# Altium schematic sheet Communication.SchDoc
size A4
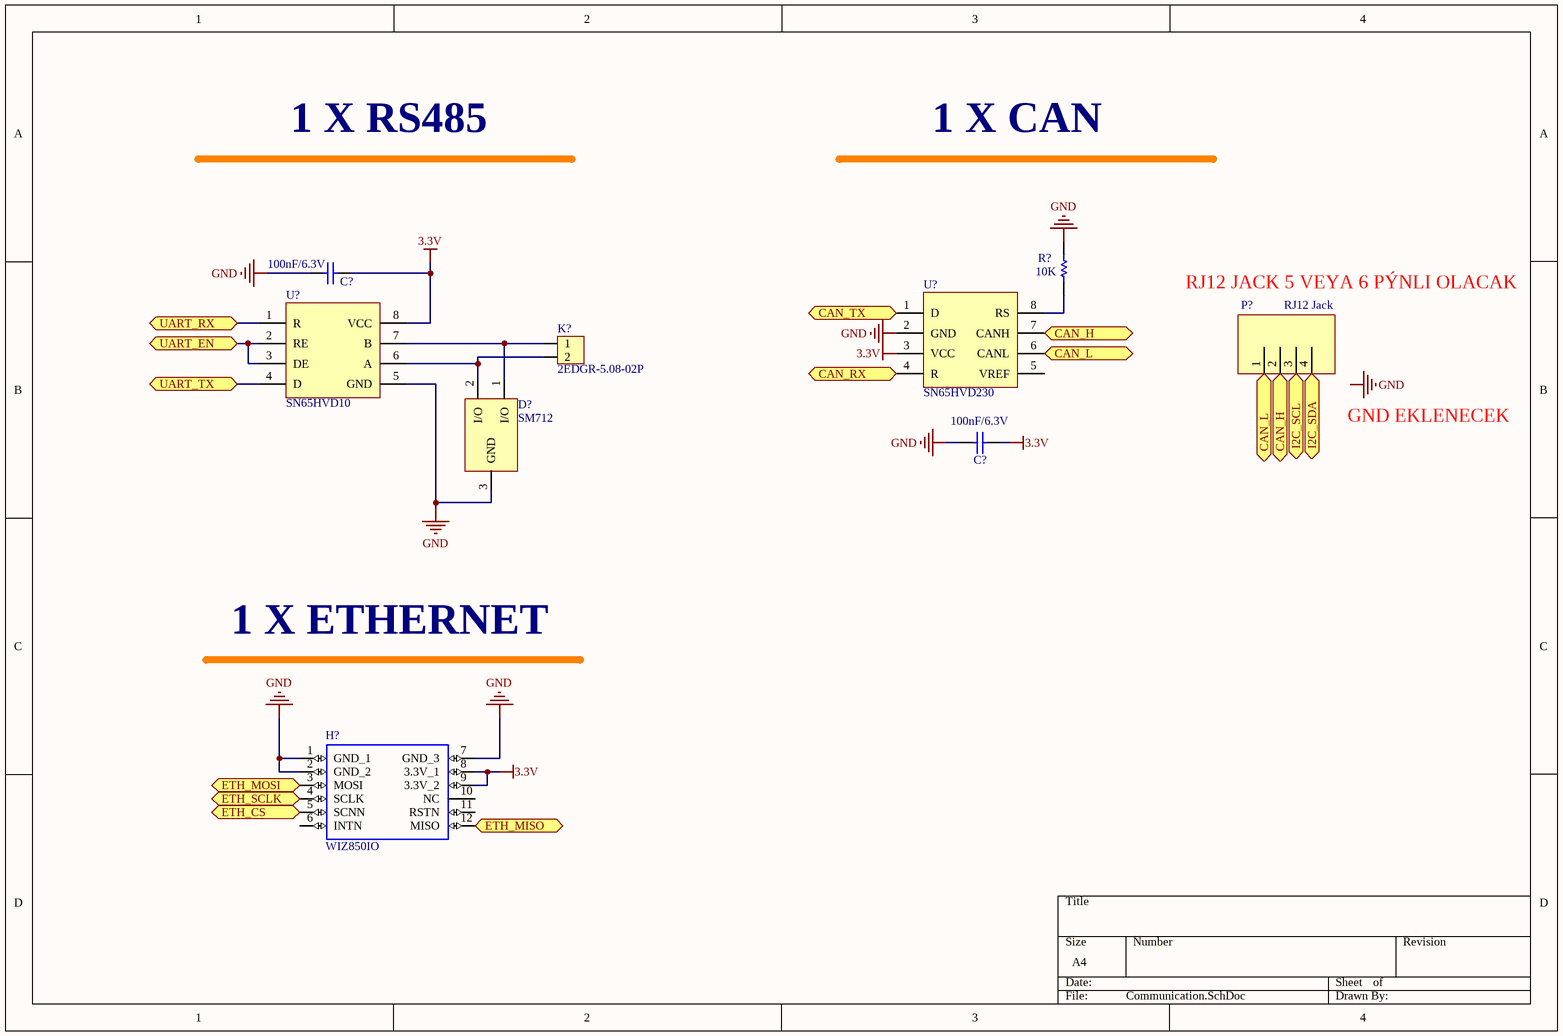
[diagram p0: Communication.SchDoc]

## Parts
(Parts that share a designator on the sheet are numbered #1, #2 ... from top to bottom, then left to right.)
C?#1  100nF/6.3V  [CAP0603W]
C?#2  100nF/6.3V  [CAP0603W]
D?  SM712  [SOT23 - BC8X6]
H?  WIZ850IO  [WIZ850IO]
K?  2EDGR-5.08-02P  [CON_DG129_02P]
P?  RJ12 Jack  [rj12_90deg_con_4p4c]
R?  10K  [RES1608[0603]]
U?#1  SN65HVD230  [SO8]
U?#2  SN65HVD10  [SO8]

## Ports
CAN_H, CAN_L, CAN_RX, CAN_TX, ETH_CS, ETH_MISO, ETH_MOSI, ETH_SCLK, I2C_SCL, I2C_SDA, UART_EN, UART_RX, UART_TX

## Nets
3.3V: C?#1.2 C?#2.2 H?.8(3.3V_1) H?.9(3.3V_2) U?#1.3(VCC) U?#2.8(VCC)
GND: C?#1.1 C?#2.1 D?.3(GND) H?.1(GND_1) H?.2(GND_2) H?.7(GND_3) R?.1 U?#1.2(GND) U?#2.5(GND)
CAN_H: P?.2 U?#1.7(CANH) ; port CAN_H
CAN_L: P?.1 U?#1.6(CANL) ; port CAN_L
CAN_RX: U?#1.4(R) ; port CAN_RX
CAN_TX: U?#1.1(D) ; port CAN_TX
ETH_CS: H?.5(SCNN) ; port ETH_CS
ETH_MISO: H?.12(MISO) ; port ETH_MISO
ETH_MOSI: H?.3(MOSI) ; port ETH_MOSI
ETH_SCLK: H?.4(SCLK) ; port ETH_SCLK
I2C_SCL: P?.3 ; port I2C_SCL
I2C_SDA: P?.4 ; port I2C_SDA
UART_EN: U?#2.2(RE) U?#2.3(DE) ; port UART_EN
UART_RX: U?#2.1(R) ; port UART_RX
UART_TX: U?#2.4(D) ; port UART_TX
NetD?_1: D?.1(I/O) K?.1 U?#2.7(B)
NetD?_2: D?.2(I/O) K?.2 U?#2.6(A)
NetR?_2: R?.2 U?#1.8(RS)

Not connected (* = marked no-connect by the designer): H? 6(INTN) 10(NC) 11(RSTN); U?#1 5(VREF)

## Notes on the sheet
- 1 X RS485
- 1 X CAN
- (near P?) RJ12 JACK 5 VEYA 6 PÝNLI OLACAK
- GND EKLENECEK
- 1 X ETHERNET
- Labels drawn without touching a wire or pin: GND

## Library data of the parts
C?#1 C?#2 = CAP1: CAPACITOR 0603 Case; Value: 100nF; Published: 8-Jun-2000; LatestRevisionDate: 17-Jul-2002; LatestRevisionNote: Re-released for DXP Platform.; PackageReference: C1206; Publisher: Altium Limited
D? = SM712: DIODE TVS Array For Rs485
H? = WIZ850IO: Ethernet - 10/100 Base-T/TX PHY SPI Interface Module; MF: WIZnet; Value: *; Package: Module WIZnet; Availability: In Stock; Check_prices: https://www.snapeda.com/parts/WIZ850IO/WIZnet/view-part/?ref=eda; SnapEDA_Link: https://www.snapeda.com/parts/WIZ850IO/WIZnet/view-part/?ref=snap; Purchase-URL: https://pricing.snapeda.com/search/part/WIZ850IO/?ref=eda; MP: WIZ850IO; Price: None
K? = KLEMENS_2P: CONNECTOR 5.08mm 2PIN 90DEG
P? = RJ12_4P4C: CONNECTOR RJ12 Jack, 90 Degree
R? = RES: RESISTOR 0603 Case %1; Value: 430R; Published: 8-Jun-2000; LatestRevisionDate: 17-Jul-2002; LatestRevisionNote: Re-released for DXP Platform.; PackageReference: AXIAL-0.5; Publisher: Altium Limited
U?#1 = SN65HVD230: CAN Interface IC 3.3V CAN Transceiver; Published: 24-Aug-2001; LatestRevisionDate: 6-Jun-2005; LatestRevisionNote: Stylized 3D Model Added.; DatasheetDocument: Feb-1998; PackageDocument: Aug-1999; PackageReference: SO8W; Publisher: Altium Limited; ComponentLink1Description: Manufacturer Link; ComponentLink1URL: http://www.st.com/
U?#2 = 75176: IC SN65HVD10DR SMD SOIC8; Published: 24-Aug-2001; LatestRevisionDate: 6-Jun-2005; LatestRevisionNote: Stylized 3D Model Added.; DatasheetDocument: Feb-1998; PackageDocument: Aug-1999; PackageReference: SO8W; Publisher: Altium Limited; ComponentLink1Description: Manufacturer Link; ComponentLink1URL: http://www.st.com/